# EAGLE design EMP4 (EAGLE 6.6.0)
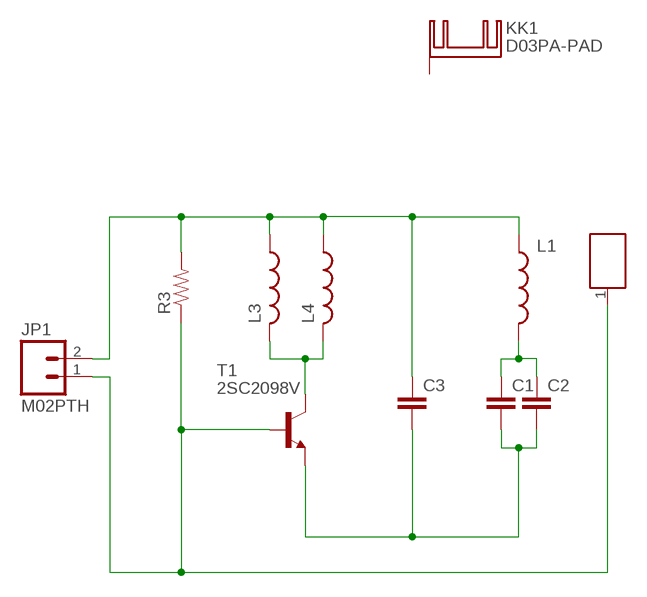
[diagram p0: schematic, sheet 1]

## Parts
C1  CAPEZ  [CAP-PTH-SMALLEZ]
C2  CAPEZ  [CAP-PTH-SMALLEZ]
C3  CAPEZ  [CAP-PTH-SMALLEZ]
JP1  M02PTH  [1X02]
KK1  D03PA-PAD  [D03PA-PAD]
L1  INDUCTORCR54-KIT  [CR54-KIT]
L3  L-USTFI0307  [TFI0307]
L4  L-USTFI0307  [TFI0307]
R3  RESISTOREZ  [AXIAL-0.3EZ]
T1  2SC2098V  [TO220AV]
U$1  L2_JOB37  [L2_JOB37]

## Nets
GND: JP1.1 R3.P$1 T1.1(B) U$1.1
N$1: C1.1 C2.1 L1.P$2
N$3: C1.2 C2.2 C3.2 T1.3(E)
N$5: L3.2 L4.2 T1.2(C)
VCC: C3.1 JP1.2 L1.P$1 L3.1 L4.1 R3.P$2
Unconnected: KK1.B(K)

## Library data of the parts
C1-C3 = SparkFun-Capacitors:CAP: Capacitor Standard 0603 ceramic capacitor, and 0.1" leaded capacitor.
JP1 = SparkFun-Connectors:M02: Standard 2-pin 0.1" header. Use with - straight break away headers ( PRT-00116) - right angle break away headers (PRT-00553) - swiss pins (PRT-00743) - machine pins (PRT-00117) - female headers (PRT-00115) Molex polarized connector foot print use with: PRT-08233 with associated crimp pins and housings. 2.54_SCREWTERM for use with PRT-10571. 3.5mm Screw Terminal footprints for PRT-08084 5mm Screw Terminal footprints for use with PRT-08433
KK1 = heatsink:D03PA-PAD: HEATSINK distributor Schukat
L1 = SparkFun-Passives:INDUCTOR: Inductors Basic Inductor/Choke - 0603 and 1206. Footprints are not proven and vary greatly between part numbers. SRN6045- 33uH, 20% 1.4A SDR0403-560KL - 56uH, 10%, 500mA RMS/740mA peak
L3 L4 = rcl:L-US: INDUCTOR, American symbol
R3 = SparkFun-Resistors:RESISTOR: Resistor Basic schematic elements and footprints for 0603, 1206, and PTH resistors.
T1 = transistor:2SC2098: NPN Epitaxial Planar Transistor RF Power Amplivier Source: 2SC2098.pdf
U$1 = L2:L2_JOB37

## Board
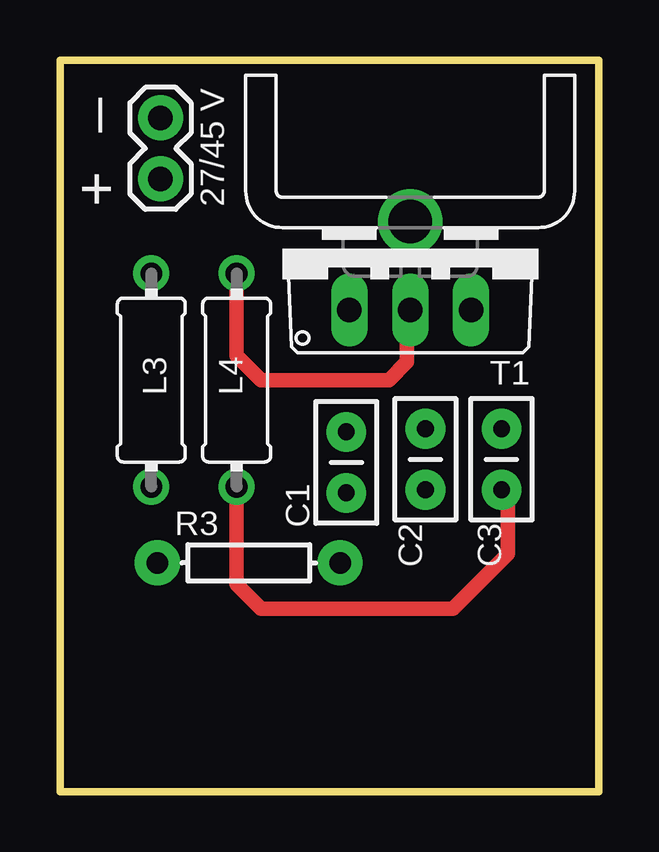
[diagram p1: board, top side]
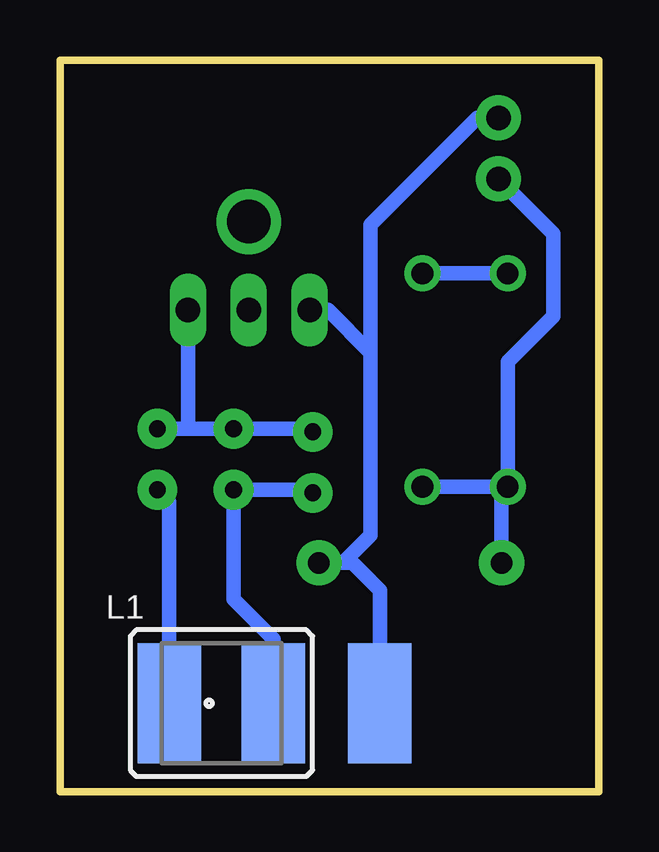
[diagram p2: board, bottom side, seen from below]

Size 22.48 x 30.48 mm. Coordinates in mm from the lower left corner, seen from the top.
Outline: 0,30.48 22.48,30.48 22.48,0 0,0 0,30.48
Copper layers (1*16): Top 0.035mm / dielectric 1.5mm / Bottom 0.035mm
Design rules "default": minimum track width 10mil, minimum drill 24mil, track to track 8mil, track to pad 8mil, pad to pad 8mil, via to via 8mil, smd to smd 8mil, copper to edge 40mil, drill to drill 8mil, minimum pad ring 10mil, minimum via ring 8mil, stop-mask expansion 4mil, vias tented up to drill 0mil, thermal gap 10mil

### Footprints (pad centres in the part's own frame; a part is rotated, then mirrored left to right if it is on the bottom)
CAP-PTH-SMALLEZ = drill 0.7 pad 1.651: 1 0,0; 2 2.54,0
1X02 = drill 1.016 pad 1.88: 1 0,0; 2 2.54,0
D03PA-PAD = drill 1.803 pad 2.54: B 0,-1.016
CR54-KIT = smd 5 x 2.65: P$1 0,2.17; P$2 0,-2.17
TFI0307 = drill 0.9 pad 1.5: 1 -4.445,0; 2 4.445,0
AXIAL-0.3EZ = drill 0.9 pad 1.88: P$1 -3.81,0; P$2 3.81,0
TO220AV = drill 1.016 long: 1 -2.54,-2.54; 2 0,-2.54; 3 2.54,-2.54
L2_JOB37 = smd 2.65 x 5: 1 0,0

### Placement (x,y rotation side)
C1  11.94,12.45 90 top
C2  15.24,12.57 90 top
C3  18.41,12.57 90 top
JP1  4.19,28.07 270 top
KK1  14.61,24.77 0 top
L1  15.75,3.68 90 bottom
L3  3.81,17.14 90 top
L4  7.37,17.14 90 top
R3  7.87,9.53 180 top
T1  14.61,22.61 0 top
U$1  9.14,3.68 180 bottom

### Tracks (layer width: path | path; a pad name or v marks a point on that pad's centre or on a via)
GND
  Bottom 0.61: R3.P$1 10.67,9.53 | 10.67,9.53 10.29,9.53 9.14,8.38 U$1.1 | T1.1 11.3,20.07 9.53,18.29 | 9.53,18.29 9.53,10.67 10.67,9.53 | JP1.1 5.08,28.07 9.53,23.62 9.53,18.29
N$1
  Bottom 0.61: L1.P$2 13.58,6.34 15.24,8 C2.1 12.06,12.57 C1.1
N$3
  Bottom 0.61: C1.2 12.06,15.11 C2.2 17.14,15.11 | C3.2 17.14,15.11 | T1.3 17.14,15.11
N$5
  Top 0.61: L4.2 7.37,18.16 8.38,17.14 13.72,17.14 14.48,17.91 14.48,19.94 T1.2
  Bottom 0.61: L3.2 L4.2
VCC
  Top 0.61: L4.1 7.37,8.64 8.38,7.62 16.38,7.62 18.67,9.91 18.67,12.32 C3.1
  Bottom 0.61: L1.P$1 17.92,12.08 C3.1 | R3.P$2 4.06,12.45 L3.1 | L3.1 L4.1 | L3.1 3.81,17.91 1.91,19.81 1.91,23.24 JP1.2

### Text on the board
tPlace: _ | + | 27/45 V